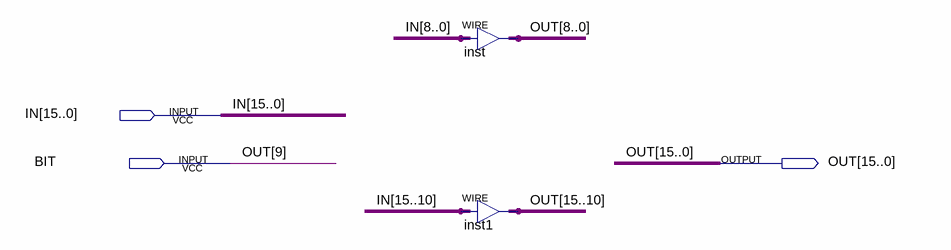
[diagram p0: schematic sheet]
// Quartus schematic BIT_REPLACER.bdf as structural Verilog: 2 symbols, 3 pins
module BIT_REPLACER (
  input  [15:0] IN,
  input  BIT,
  output [15:0] OUT
);

  assign OUT[8:0] = IN[8:0];  // WIRE inst
  assign OUT[15:10] = IN[15:10];  // WIRE inst1

  assign OUT[9] = BIT;
endmodule
